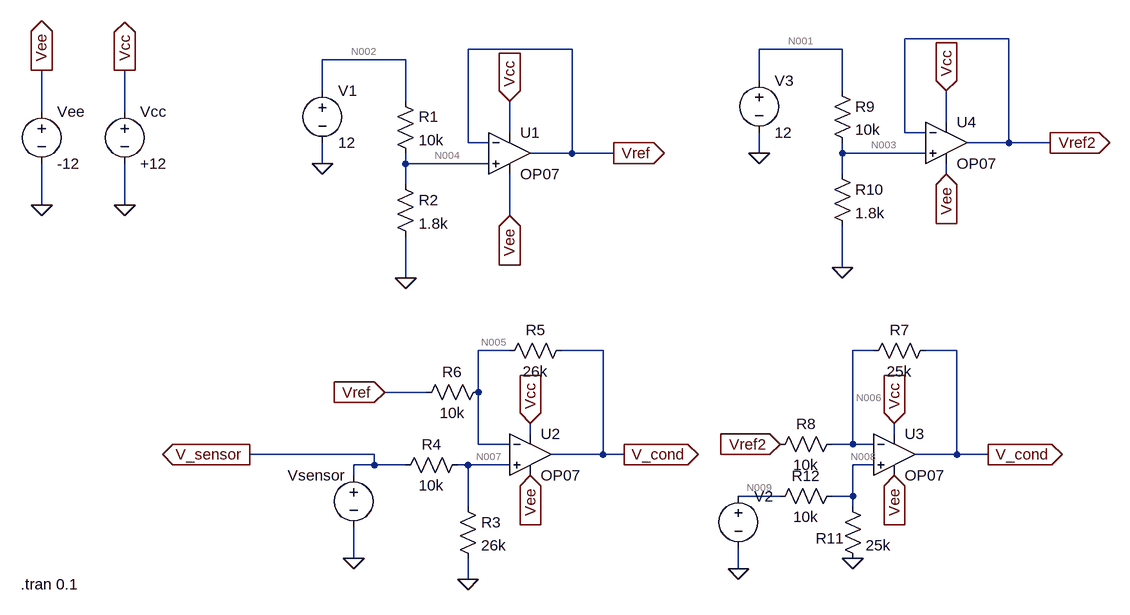
[diagram p0: schematic current_sensor_conditioning.asc]
current_sensor_conditioning.asc, the LTspice schematic file:
Version 4
SHEET 1 1260 680
WIRE 992 -192 832 -192
WIRE 320 -176 160 -176
WIRE 736 -176 608 -176
WIRE 64 -160 -64 -160
WIRE 608 -128 608 -176
WIRE -64 -112 -64 -160
WIRE 736 -112 736 -176
WIRE 64 -96 64 -160
WIRE -496 -80 -496 -144
WIRE -368 -80 -368 -144
WIRE 896 -64 896 -112
WIRE 224 -48 224 -96
WIRE 832 -48 832 -192
WIRE 864 -48 832 -48
WIRE 160 -32 160 -176
WIRE 192 -32 160 -32
WIRE 992 -32 992 -192
WIRE 992 -32 928 -32
WIRE 1056 -32 992 -32
WIRE 320 -16 320 -176
WIRE 320 -16 256 -16
WIRE 384 -16 320 -16
WIRE 608 -16 608 -48
WIRE 736 -16 736 -32
WIRE 864 -16 736 -16
WIRE -64 0 -64 -32
WIRE 64 0 64 -16
WIRE 192 0 64 0
WIRE 736 16 736 -16
WIRE 896 16 896 0
WIRE 64 32 64 0
WIRE -496 64 -496 0
WIRE -368 64 -368 0
WIRE 224 80 224 16
WIRE 736 160 736 96
WIRE 64 176 64 112
WIRE 224 288 176 288
WIRE 368 288 304 288
WIRE 784 288 752 288
WIRE 912 288 864 288
WIRE 96 352 32 352
WIRE 176 352 176 288
WIRE 256 416 256 400
WIRE 816 416 816 400
WIRE 176 432 176 352
WIRE 224 432 176 432
WIRE 752 432 752 288
WIRE 752 432 720 432
WIRE 784 432 752 432
WIRE 16 448 -176 448
WIRE 368 448 368 288
WIRE 368 448 288 448
WIRE 400 448 368 448
WIRE 912 448 912 288
WIRE 912 448 848 448
WIRE 960 448 912 448
WIRE 16 464 16 448
WIRE 16 464 -16 464
WIRE 64 464 16 464
WIRE 160 464 144 464
WIRE 224 464 160 464
WIRE 784 464 752 464
WIRE -16 480 -16 464
WIRE 640 512 576 512
WIRE 752 512 752 464
WIRE 752 512 720 512
WIRE 160 528 160 464
WIRE 752 528 752 512
WIRE -16 608 -16 560
WIRE 576 624 576 592
WIRE 160 640 160 608
FLAG -368 -144 Vcc
IOPIN -368 -144 Out
FLAG -368 64 0
FLAG -496 64 0
FLAG -496 -144 Vee
IOPIN -496 -144 Out
FLAG 256 400 Vcc
IOPIN 256 400 In
FLAG 256 480 Vee
IOPIN 256 480 In
FLAG 64 176 0
FLAG -64 0 0
FLAG -16 608 0
FLAG 160 640 0
FLAG 224 -96 Vcc
IOPIN 224 -96 In
FLAG 224 80 Vee
IOPIN 224 80 In
FLAG 384 -16 Vref
IOPIN 384 -16 Out
FLAG 32 352 Vref
IOPIN 32 352 In
FLAG 816 400 Vcc
IOPIN 816 400 In
FLAG 816 480 Vee
IOPIN 816 480 In
FLAG 576 624 0
FLAG 736 160 0
FLAG 608 -16 0
FLAG 896 -112 Vcc
IOPIN 896 -112 In
FLAG 896 16 Vee
IOPIN 896 16 In
FLAG 1056 -32 Vref2
IOPIN 1056 -32 Out
FLAG 640 432 Vref2
IOPIN 640 432 In
FLAG 752 608 0
FLAG 400 448 V_cond
IOPIN 400 448 Out
FLAG 960 448 V_cond
IOPIN 960 448 Out
FLAG -176 448 V_sensor
IOPIN -176 448 Out
SYMBOL OpAmps\\OP07 256 384 R0
SYMATTR InstName U2
SYMBOL voltage -368 -96 R0
WINDOW 123 0 0 Left 0
WINDOW 39 0 0 Left 0
SYMATTR InstName Vcc
SYMATTR Value +12
SYMBOL voltage -496 -96 R0
WINDOW 123 0 0 Left 0
WINDOW 39 0 0 Left 0
SYMATTR InstName Vee
SYMATTR Value -12
SYMBOL res 48 -112 R0
SYMATTR InstName R1
SYMATTR Value 10k
SYMBOL res 48 16 R0
SYMATTR InstName R2
SYMATTR Value 1.8k
SYMBOL voltage -64 -128 R0
WINDOW 123 0 0 Left 0
WINDOW 39 0 0 Left 0
SYMATTR InstName V1
SYMATTR Value 12
SYMBOL voltage -16 464 R0
WINDOW 0 -101 16 Left 2
WINDOW 3 24 96 Invisible 2
WINDOW 123 0 0 Left 0
WINDOW 39 0 0 Left 0
SYMATTR InstName Vsensor
SYMATTR Value SINE(2.5 0.622 50)
SYMBOL res 144 512 R0
SYMATTR InstName R3
SYMATTR Value 26k
SYMBOL res 160 448 R90
WINDOW 0 0 56 VBottom 2
WINDOW 3 32 56 VTop 2
SYMATTR InstName R4
SYMATTR Value 10k
SYMBOL res 320 272 R90
WINDOW 0 0 56 VBottom 2
WINDOW 3 32 56 VTop 2
SYMATTR InstName R5
SYMATTR Value 26k
SYMBOL res 192 336 R90
WINDOW 0 0 56 VBottom 2
WINDOW 3 32 56 VTop 2
SYMATTR InstName R6
SYMATTR Value 10k
SYMBOL OpAmps\\OP07 224 -80 R0
SYMATTR InstName U1
SYMBOL OpAmps\\OP07 816 384 R0
SYMATTR InstName U3
SYMBOL res 880 272 R90
WINDOW 0 0 56 VBottom 2
WINDOW 3 32 56 VTop 2
SYMATTR InstName R7
SYMATTR Value 25k
SYMBOL res 736 416 R90
WINDOW 0 0 56 VBottom 2
WINDOW 3 32 56 VTop 2
SYMATTR InstName R8
SYMATTR Value 10k
SYMBOL voltage 576 496 R0
WINDOW 3 24 96 Invisible 2
WINDOW 123 0 0 Left 0
WINDOW 39 0 0 Left 0
SYMATTR Value SINE(2.5 0.7 50)
SYMATTR InstName V2
SYMBOL res 720 -128 R0
SYMATTR InstName R9
SYMATTR Value 10k
SYMBOL res 720 0 R0
SYMATTR InstName R10
SYMATTR Value 1.8k
SYMBOL voltage 608 -144 R0
WINDOW 123 0 0 Left 0
WINDOW 39 0 0 Left 0
SYMATTR InstName V3
SYMATTR Value 12
SYMBOL OpAmps\\OP07 896 -96 R0
SYMATTR InstName U4
SYMBOL res 736 512 R0
WINDOW 0 -41 65 Left 2
SYMATTR InstName R11
SYMATTR Value 25k
SYMBOL res 736 496 R90
WINDOW 0 0 56 VBottom 2
WINDOW 3 32 56 VTop 2
SYMATTR InstName R12
SYMATTR Value 10k
TEXT -528 648 Left 2 !.tran 0.1

The netlist it stands for:
* current_sensor_conditioning.asc
XU2 N007 N005 Vcc Vee V_cond LT1001  ; OP07, pins In+ In- V+ V- OUT
Vcc Vcc 0 +12
Vee Vee 0 -12
R1 N002 N004 10k
R2 N004 0 1.8k
V1 N002 0 12
Vsensor V_sensor 0 SINE(2.5 0.622 50)
R3 N007 0 26k
R4 N007 V_sensor 10k
R5 V_cond N005 26k
R6 N005 Vref 10k
XU1 N004 Vref Vcc Vee Vref LT1001  ; OP07, pins In+ In- V+ V- OUT
XU3 N008 N006 Vcc Vee V_cond LT1001  ; OP07, pins In+ In- V+ V- OUT
R7 V_cond N006 25k
R8 N006 Vref2 10k
V2 N009 0 SINE(2.5 0.7 50)
R9 N001 N003 10k
R10 N003 0 1.8k
V3 N001 0 12
XU4 N003 Vref2 Vcc Vee Vref2 LT1001  ; OP07, pins In+ In- V+ V- OUT
R11 N008 0 25k
R12 N008 N009 10k
.tran 0.1
.lib LTC.lib
.backanno
.end

* Results of the author's LTspice run, read from the files saved beside the schematic
* Operating Point, zero values left out:
*   V(n005) = 1.796 V
*   V(n007) = 1.806 V
*   V(vcc) = 12 V
*   V(vee) = -12 V
*   V(v_cond) = 1.707 V
*   V(n002) = 12 V
*   V(n004) = 1.831 V
*   V(v_sensor) = 2.5 V
*   V(vref) = 1.831 V
*   V(n006) = 1.795 V
*   V(n008) = 1.786 V
*   V(vref2) = 1.831 V
*   V(n009) = 2.5 V
*   V(n001) = 12 V
*   V(n003) = 1.831 V
*   I(R1) = 1.017 mA
*   I(R2) = 1.017 mA
*   I(R3) = 69.44 µA
*   I(R4) = -69.44 µA
*   I(R5) = -3.436 µA
*   I(R6) = -3.436 µA
*   I(R7) = -3.534 µA
*   I(R8) = -3.534 µA
*   I(R9) = 1.017 mA
*   I(R10) = 1.017 mA
*   I(R11) = 71.43 µA
*   I(R12) = -71.43 µA
*   I(Vcc) = -38.89 mA
*   I(Vee) = 38.89 mA
*   I(V1) = -1.017 mA
*   I(Vsensor) = -69.44 µA
*   I(V2) = -71.43 µA
*   I(V3) = -1.017 mA
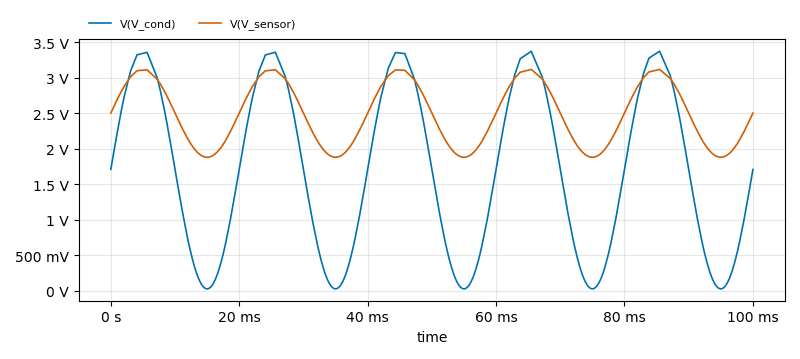
[diagram p1: Transient Analysis of current_sensor_conditioning.asc, plotted from the saved traces]
* Transient Analysis, 1 run:
*   V(V_cond): min 25.04 mV, max 3.371 V, average 1.701 V, rms 2.073 V, last 1.706 V
*   V(V_sensor): min 1.878 V, max 3.115 V, average 2.498 V, rms 2.536 V, last 2.5 V